# Altium project ECSE478 - Demo Expansion Board.PrjPcb
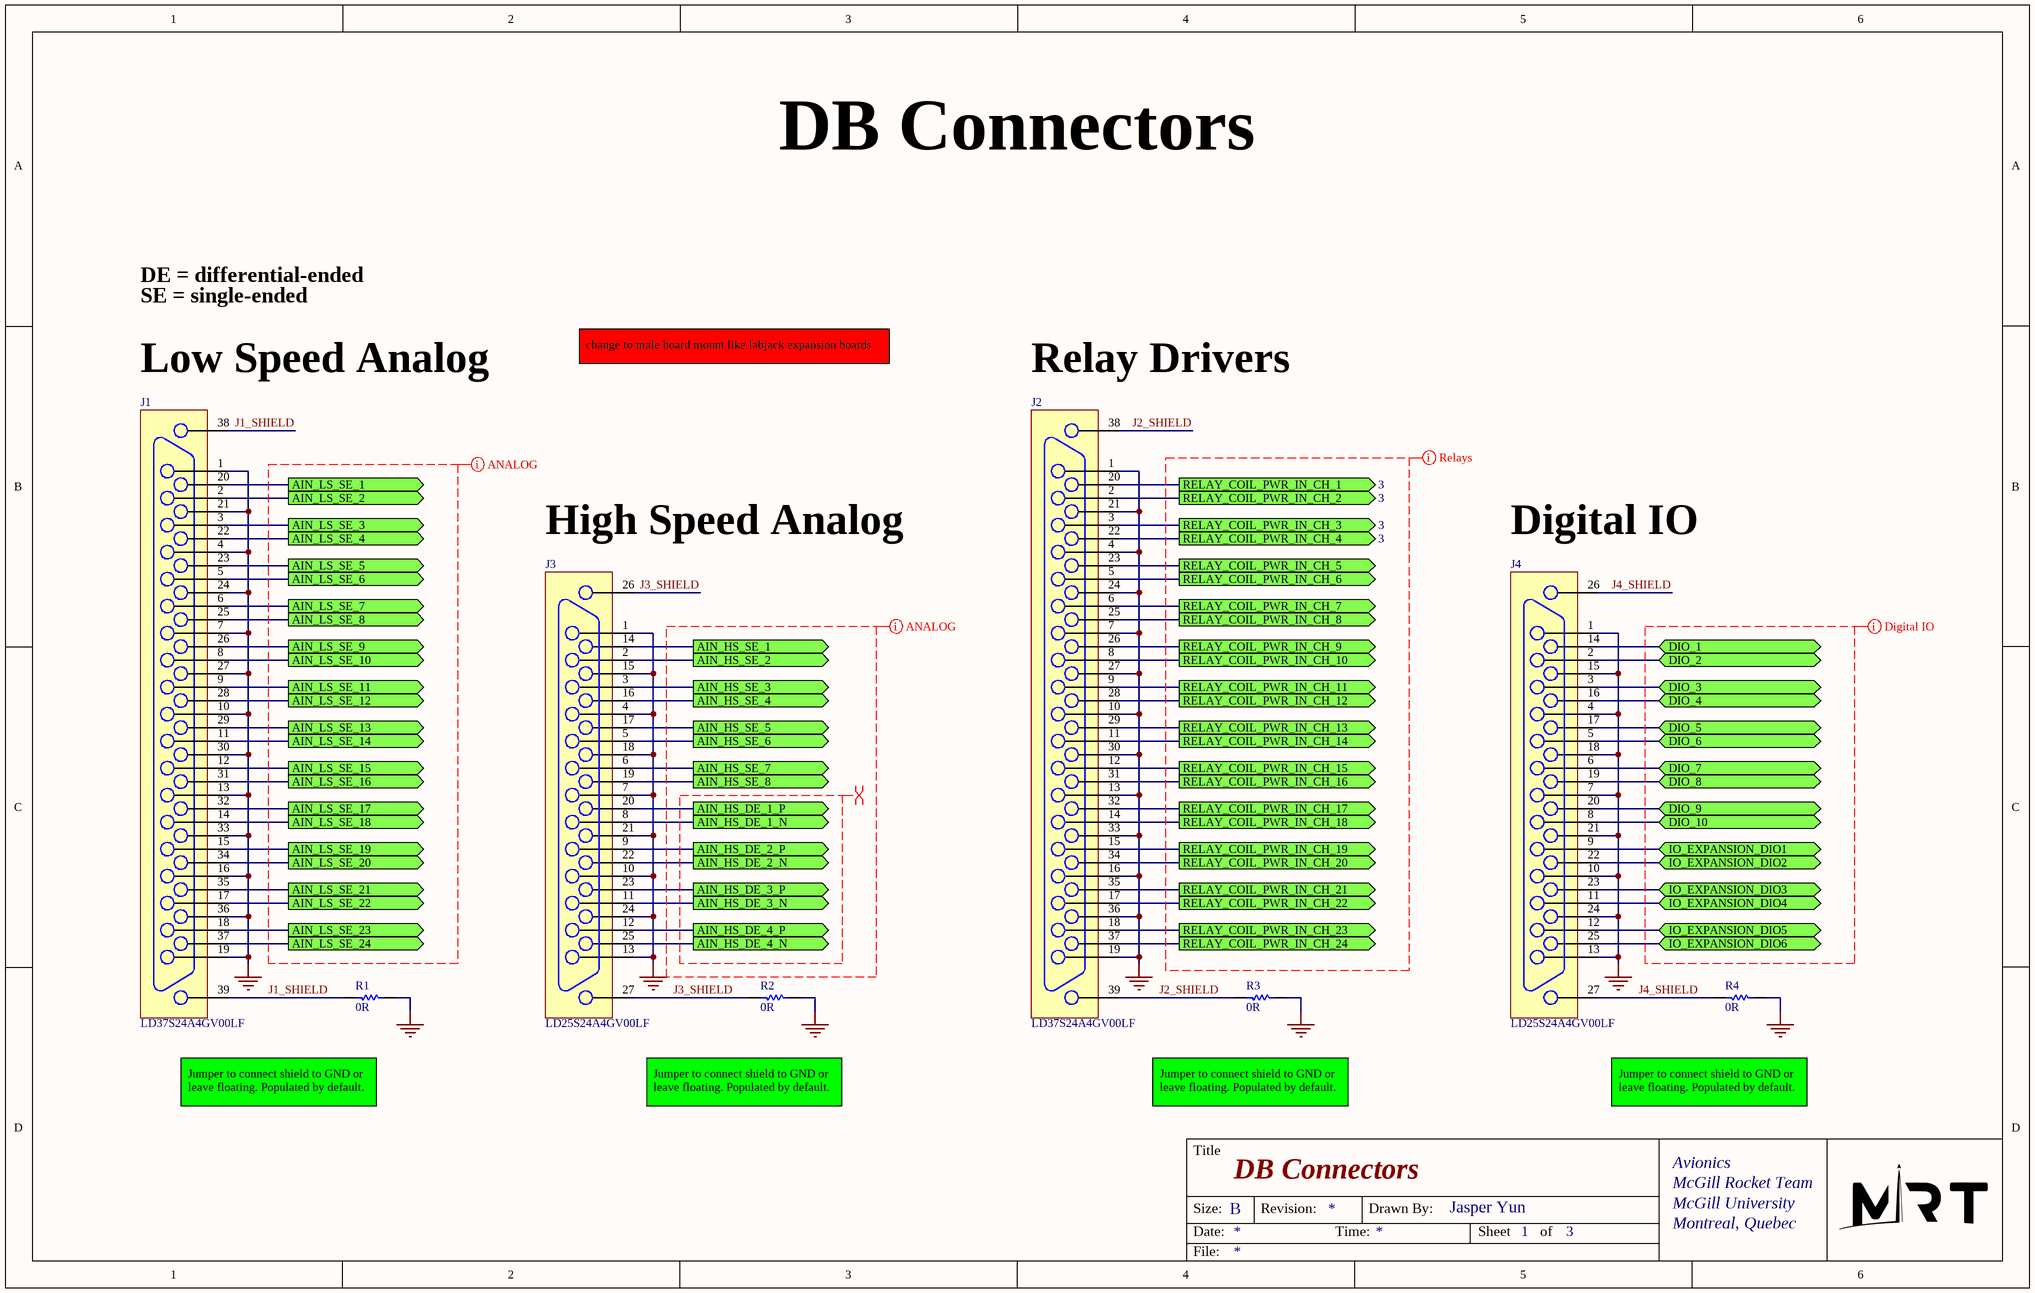
[diagram p0: DB Connectors.SchDoc]
4 sheets, 52 parts. Net scope: flat (ports and power ports of the same name join across sheets).
Sheets:
  DB Connectors.SchDoc
  Power.SchDoc
  Relays and Digital.SchDoc
  Analog Circuits.SchDoc

## Sheet DB Connectors.SchDoc: DB Connectors
size B; DrawnBy: Jasper Yun; SheetNumber: 1; SheetTotal: 3; Competition: SAC 2021; Subteam: Avionics; University: McGill University; Location: Montreal, Quebec; Project: Avionics Project Name; MRT: McGill Rocket Team

### Parts
J1  LD37S24A4GV00LF  [Connector DB37 Vertical LD37S24A4GV00LF]
J2  LD37S24A4GV00LF  [Connector DB37 Vertical LD37S24A4GV00LF]
J3  LD25S24A4GV00LF  [Connector DB25 Vertical LD25S24A4GV00LF]
J4  LD25S24A4GV00LF  [Connector DB25 Vertical LD25S24A4GV00LF]
R1  0R  [0402 RES]
R2  0R  [0402 RES]
R3  0R  [0402 RES]
R4  0R  [0402 RES]

### Ports
AIN_HS_DE_1_N (out), AIN_HS_DE_1_P (out), AIN_HS_DE_2_N (out), AIN_HS_DE_2_P (out), AIN_HS_DE_3_N (out), AIN_HS_DE_3_P (out), AIN_HS_DE_4_N (out), AIN_HS_DE_4_P (out), AIN_HS_SE_1 (out), AIN_HS_SE_2 (out), AIN_HS_SE_3 (out), AIN_HS_SE_4 (out), AIN_HS_SE_5 (out), AIN_HS_SE_6 (out), AIN_HS_SE_7 (out), AIN_HS_SE_8 (out), AIN_LS_SE_1 (out), AIN_LS_SE_2 (out), AIN_LS_SE_3 (out), AIN_LS_SE_4 (out), AIN_LS_SE_5 (out), AIN_LS_SE_6 (out), AIN_LS_SE_7 (out), AIN_LS_SE_8 (out), AIN_LS_SE_9 (out), AIN_LS_SE_10 (out), AIN_LS_SE_11 (out), AIN_LS_SE_12 (out), AIN_LS_SE_13 (out), AIN_LS_SE_14 (out), AIN_LS_SE_15 (out), AIN_LS_SE_16 (out), AIN_LS_SE_17 (out), AIN_LS_SE_18 (out), AIN_LS_SE_19 (out), AIN_LS_SE_20 (out), AIN_LS_SE_21 (out), AIN_LS_SE_22 (out), AIN_LS_SE_23 (out), AIN_LS_SE_24 (out), DIO_1 (bidir), DIO_2 (bidir), DIO_3 (bidir), DIO_4 (bidir), DIO_5 (bidir), DIO_6 (bidir), DIO_7 (bidir), DIO_8 (bidir), DIO_9 (bidir), DIO_10 (bidir), IO_EXPANSION_DIO1 (bidir), IO_EXPANSION_DIO2 (bidir), IO_EXPANSION_DIO3 (bidir), IO_EXPANSION_DIO4 (bidir), IO_EXPANSION_DIO5 (bidir), IO_EXPANSION_DIO6 (bidir), RELAY_COIL_PWR_IN_CH_1 (out, see 3), RELAY_COIL_PWR_IN_CH_2 (out, see 3), RELAY_COIL_PWR_IN_CH_3 (out, see 3), RELAY_COIL_PWR_IN_CH_4 (out, see 3), RELAY_COIL_PWR_IN_CH_5 (out), RELAY_COIL_PWR_IN_CH_6 (out), RELAY_COIL_PWR_IN_CH_7 (out), RELAY_COIL_PWR_IN_CH_8 (out), RELAY_COIL_PWR_IN_CH_9 (out), RELAY_COIL_PWR_IN_CH_10 (out), RELAY_COIL_PWR_IN_CH_11 (out), RELAY_COIL_PWR_IN_CH_12 (out), RELAY_COIL_PWR_IN_CH_13 (out), RELAY_COIL_PWR_IN_CH_14 (out), RELAY_COIL_PWR_IN_CH_15 (out), RELAY_COIL_PWR_IN_CH_16 (out), RELAY_COIL_PWR_IN_CH_17 (out), RELAY_COIL_PWR_IN_CH_18 (out), RELAY_COIL_PWR_IN_CH_19 (out), RELAY_COIL_PWR_IN_CH_20 (out), RELAY_COIL_PWR_IN_CH_21 (out), RELAY_COIL_PWR_IN_CH_22 (out), RELAY_COIL_PWR_IN_CH_23 (out), RELAY_COIL_PWR_IN_CH_24 (out)

### Nets
GND: J1.1 J1.4 J1.7 J1.10 J1.13 J1.16 J1.19 J1.21 J1.24 J1.27 J1.30 J1.33 J1.36 J2.1 J2.4 J2.7 J2.10 J2.13 J2.16 J2.19 J2.21 J2.24 J2.27 J2.30 J2.33 J2.36 J3.1 J3.4 J3.7 J3.10 J3.13 J3.15 J3.18 J3.21 J3.24 J4.1 J4.4 J4.7 J4.10 J4.13 J4.15 J4.18 J4.21 J4.24 R1.2 R2.2 R3.2 R4.2
J1_SHIELD: J1.38 J1.39 R1.1
J2_SHIELD: J2.38 J2.39 R3.1
J3_SHIELD: J3.26 J3.27 R2.1
J4_SHIELD: J4.26 J4.27 R4.1
NetD1_2: J2.20 ; port RELAY_COIL_PWR_IN_CH_1
NetD2_2: J2.2 ; port RELAY_COIL_PWR_IN_CH_2
NetD3_2: J2.3 ; port RELAY_COIL_PWR_IN_CH_3
NetD4_2: J2.22 ; port RELAY_COIL_PWR_IN_CH_4
NetJ1_2: J1.2 ; port AIN_LS_SE_2
NetJ1_3: J1.3 ; port AIN_LS_SE_3
NetJ1_5: J1.5 ; port AIN_LS_SE_6
NetJ1_6: J1.6 ; port AIN_LS_SE_7
NetJ1_8: J1.8 ; port AIN_LS_SE_10
NetJ1_9: J1.9 ; port AIN_LS_SE_11
NetJ1_11: J1.11 ; port AIN_LS_SE_14
NetJ1_12: J1.12 ; port AIN_LS_SE_15
NetJ1_14: J1.14 ; port AIN_LS_SE_18
NetJ1_15: J1.15 ; port AIN_LS_SE_19
NetJ1_17: J1.17 ; port AIN_LS_SE_22
NetJ1_18: J1.18 ; port AIN_LS_SE_23
NetJ1_20: J1.20 ; port AIN_LS_SE_1
NetJ1_22: J1.22 ; port AIN_LS_SE_4
NetJ1_23: J1.23 ; port AIN_LS_SE_5
NetJ1_25: J1.25 ; port AIN_LS_SE_8
NetJ1_26: J1.26 ; port AIN_LS_SE_9
NetJ1_28: J1.28 ; port AIN_LS_SE_12
NetJ1_29: J1.29 ; port AIN_LS_SE_13
NetJ1_31: J1.31 ; port AIN_LS_SE_16
NetJ1_32: J1.32 ; port AIN_LS_SE_17
NetJ1_34: J1.34 ; port AIN_LS_SE_20
NetJ1_35: J1.35 ; port AIN_LS_SE_21
NetJ1_37: J1.37 ; port AIN_LS_SE_24
NetJ2_5: J2.5 ; port RELAY_COIL_PWR_IN_CH_6
NetJ2_6: J2.6 ; port RELAY_COIL_PWR_IN_CH_7
NetJ2_8: J2.8 ; port RELAY_COIL_PWR_IN_CH_10
NetJ2_9: J2.9 ; port RELAY_COIL_PWR_IN_CH_11
NetJ2_11: J2.11 ; port RELAY_COIL_PWR_IN_CH_14
NetJ2_12: J2.12 ; port RELAY_COIL_PWR_IN_CH_15
NetJ2_14: J2.14 ; port RELAY_COIL_PWR_IN_CH_18
NetJ2_15: J2.15 ; port RELAY_COIL_PWR_IN_CH_19
NetJ2_17: J2.17 ; port RELAY_COIL_PWR_IN_CH_22
NetJ2_18: J2.18 ; port RELAY_COIL_PWR_IN_CH_23
NetJ2_23: J2.23 ; port RELAY_COIL_PWR_IN_CH_5
NetJ2_25: J2.25 ; port RELAY_COIL_PWR_IN_CH_8
NetJ2_26: J2.26 ; port RELAY_COIL_PWR_IN_CH_9
NetJ2_28: J2.28 ; port RELAY_COIL_PWR_IN_CH_12
NetJ2_29: J2.29 ; port RELAY_COIL_PWR_IN_CH_13
NetJ2_31: J2.31 ; port RELAY_COIL_PWR_IN_CH_16
NetJ2_32: J2.32 ; port RELAY_COIL_PWR_IN_CH_17
NetJ2_34: J2.34 ; port RELAY_COIL_PWR_IN_CH_20
NetJ2_35: J2.35 ; port RELAY_COIL_PWR_IN_CH_21
NetJ2_37: J2.37 ; port RELAY_COIL_PWR_IN_CH_24
NetJ3_2: J3.2 ; port AIN_HS_SE_2
NetJ3_3: J3.3 ; port AIN_HS_SE_3
NetJ3_5: J3.5 ; port AIN_HS_SE_6
NetJ3_6: J3.6 ; port AIN_HS_SE_7
NetJ3_8: J3.8 ; port AIN_HS_DE_1_N
NetJ3_9: J3.9 ; port AIN_HS_DE_2_P
NetJ3_11: J3.11 ; port AIN_HS_DE_3_N
NetJ3_12: J3.12 ; port AIN_HS_DE_4_P
NetJ3_14: J3.14 ; port AIN_HS_SE_1
NetJ3_16: J3.16 ; port AIN_HS_SE_4
NetJ3_17: J3.17 ; port AIN_HS_SE_5
NetJ3_19: J3.19 ; port AIN_HS_SE_8
NetJ3_20: J3.20 ; port AIN_HS_DE_1_P
NetJ3_22: J3.22 ; port AIN_HS_DE_2_N
NetJ3_23: J3.23 ; port AIN_HS_DE_3_P
NetJ3_25: J3.25 ; port AIN_HS_DE_4_N
NetJ4_2: J4.2 ; port DIO_2
NetJ4_3: J4.3 ; port DIO_3
NetJ4_5: J4.5 ; port DIO_6
NetJ4_6: J4.6 ; port DIO_7
NetJ4_8: J4.8 ; port DIO_10
NetJ4_9: J4.9 ; port IO_EXPANSION_DIO1
NetJ4_11: J4.11 ; port IO_EXPANSION_DIO4
NetJ4_12: J4.12 ; port IO_EXPANSION_DIO5
NetJ4_14: J4.14 ; port DIO_1
NetJ4_16: J4.16 ; port DIO_4
NetJ4_17: J4.17 ; port DIO_5
NetJ4_19: J4.19 ; port DIO_8
NetJ4_20: J4.20 ; port DIO_9
NetJ4_22: J4.22 ; port IO_EXPANSION_DIO2
NetJ4_23: J4.23 ; port IO_EXPANSION_DIO3
NetJ4_25: J4.25 ; port IO_EXPANSION_DIO6

### Layout directives
differential pair; differential pair class AIN_HS_DE: (no net found under the mark)
net class ANALOG: (no net found under the mark)
net class Digital IO: (no net found under the mark)
net class Relays: (no net found under the mark)

### Notes on the sheet
- DE = differential-ended
- SE = single-ended
- change to male board mount like labjack expansion boards
- (near J1) Low Speed Analog
- (near J2) Relay Drivers
- (near J3) High Speed Analog
- (near J4) Digital IO
- Jumper to connect shield to GND or leave floating. Populated by default.
- Title
- Size:
- Date:
- B
- Revision:
- Time:
- Drawn By:
- Sheet
- of
- File:

### Library data of the parts
J1 J2 = Connector DB37 (LD37S24A4GV00LF): DB37 LD37S24A4GV00LF (Amphenol ICC)
J3 J4 = Connector DB25 (LD25S24A4GV00LF): DB25 LD25S24A4GV00LF (Amphenol ICC)
R1-R4 = Res1: Resistor; Value: 1%; Published: 8-Jun-2000; LatestRevisionDate: 17-Jul-2002; LatestRevisionNote: Re-released for DXP Platform.; PackageReference: AXIAL-0.3; Publisher: Altium Limited; PackageDescription: Axial Device, Thru-Hole; 2 Leads; 0.3 in Pin Spacing

## Sheet Power.SchDoc: Power
size B; DrawnBy: Jasper Yun; SheetNumber: 2; SheetTotal: 3; Competition: SAC 2021; Subteam: Avionics; University: McGill University; Location: Montreal, Quebec; Project: Avionics Project Name; MRT: McGill Rocket Team
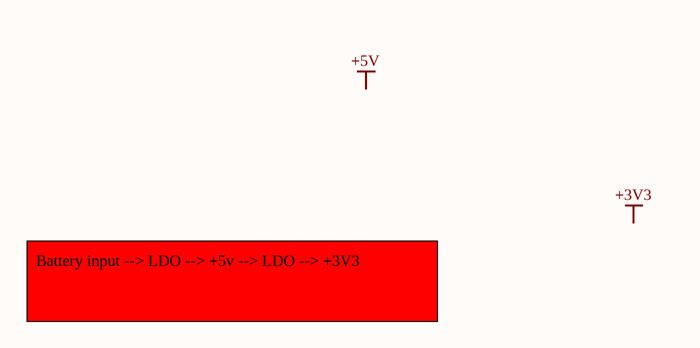
[diagram p1: Power.SchDoc]

### Notes on the sheet
- Battery input --> LDO --> +5v --> LDO --> +3V3
- Labels drawn without touching a wire or pin: +3V3, +5V
- Title
- Size:
- Date:
- B
- Revision:
- Time:
- Drawn By:
- Sheet
- of
- File:

## Sheet Relays and Digital.SchDoc: Relays and Digital
size B; DrawnBy: Jasper Yun; SheetNumber: 3; SheetTotal: 3; Competition: SAC 2021; Subteam: Avionics; University: McGill University; Location: Montreal, Quebec; Project: Avionics Project Name; MRT: McGill Rocket Team
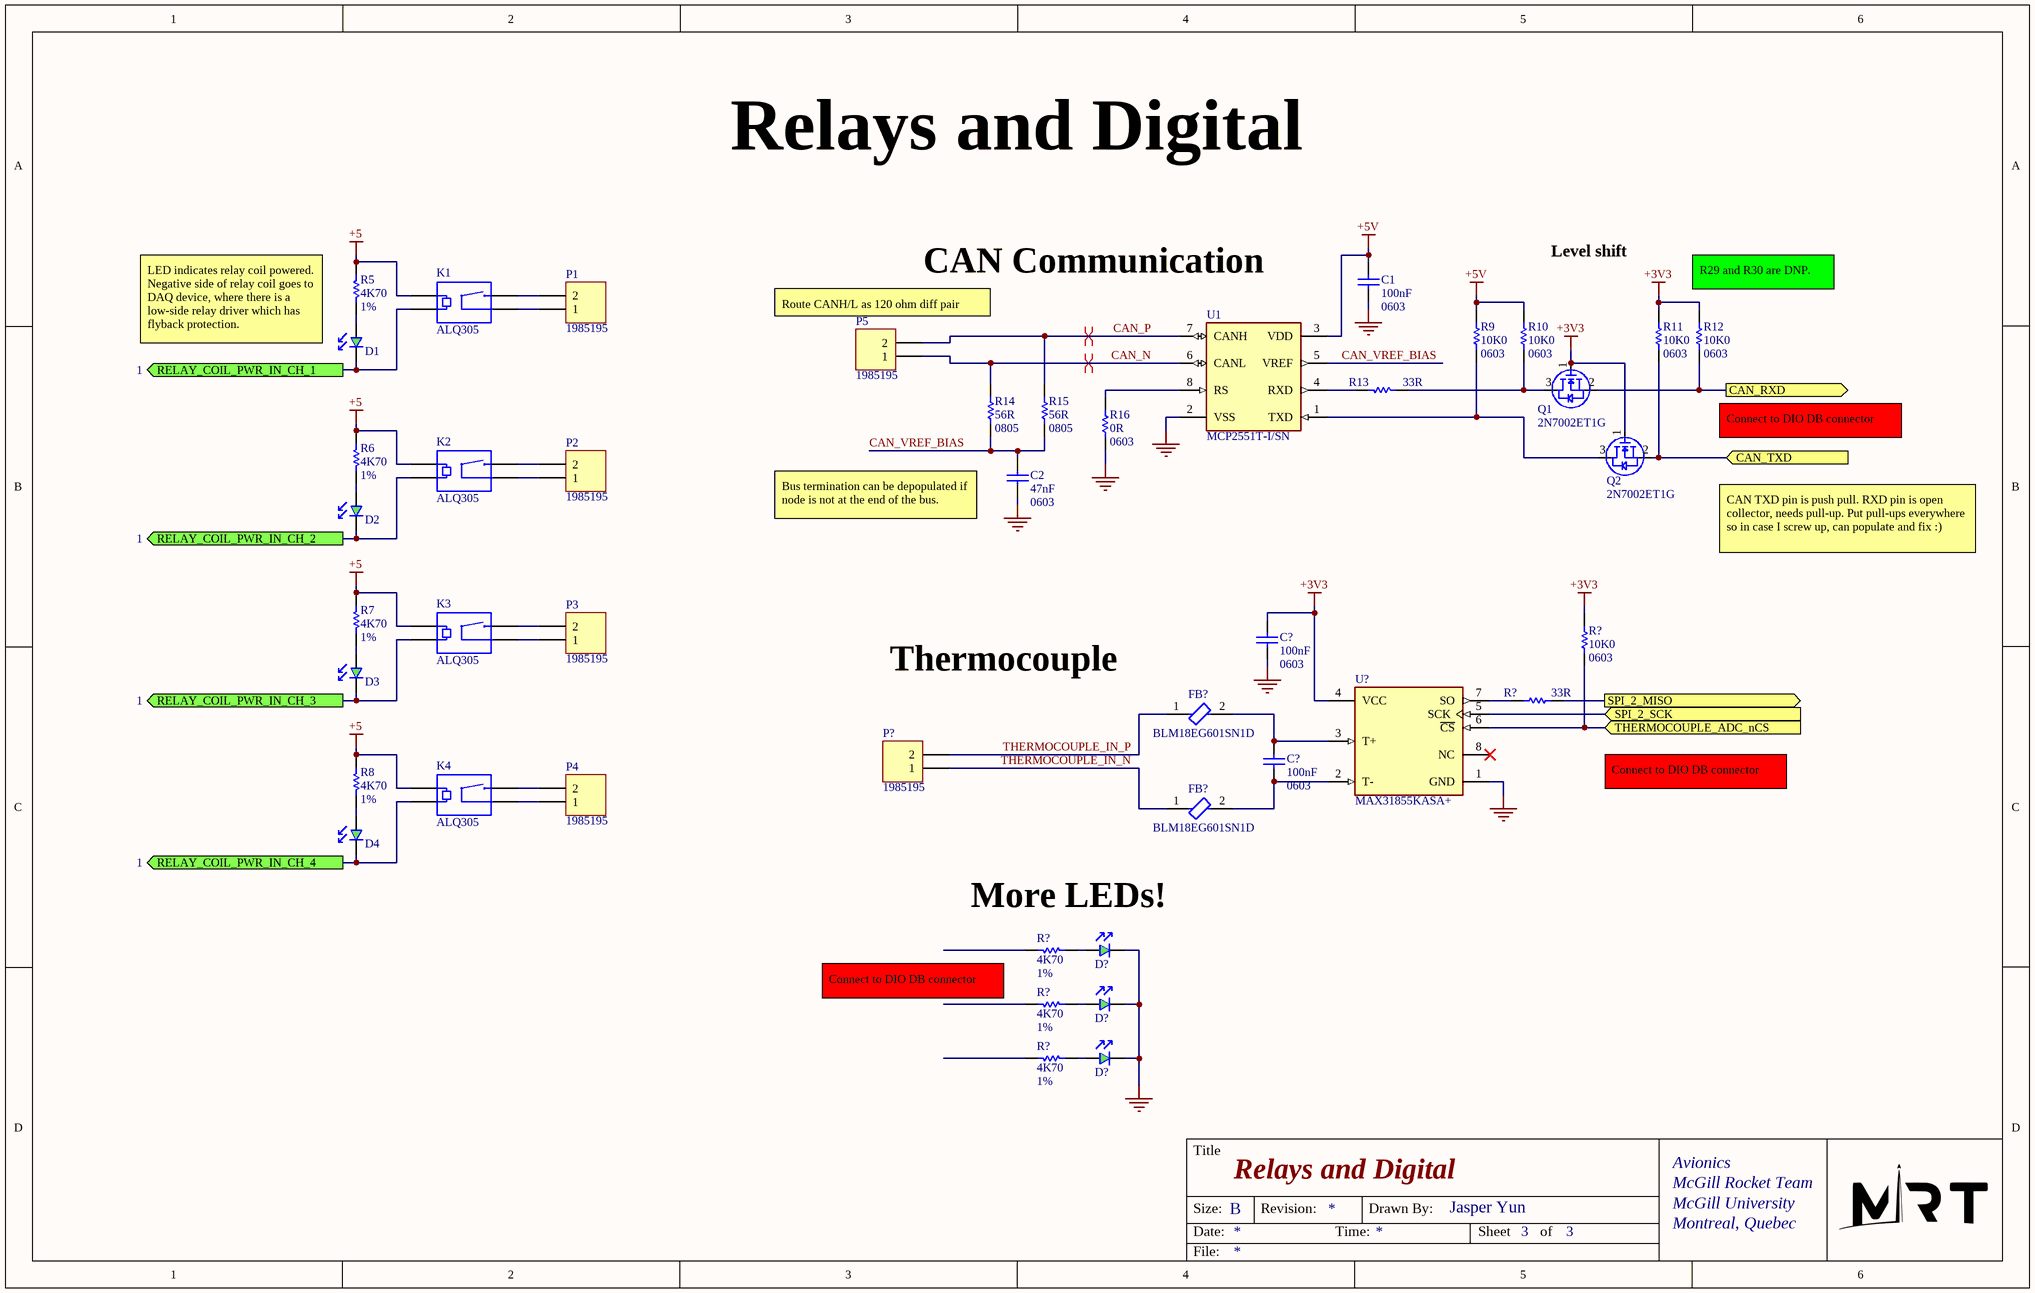
[diagram p2: Relays and Digital.SchDoc]

### Parts
(Parts that share a designator on the sheet are numbered #1, #2 ... from top to bottom, then left to right.)
C1  100nF  value 0603  [0603 CAP SAMSUNG CL10C]
C2  47nF  value 0603  [0603 CAP SAMSUNG CL10C]
C?#1  100nF  value 0603  [0603 CAP SAMSUNG CL10C]
C?#2  100nF  value 0603  [0603 CAP SAMSUNG CL10C]
D1  LED Green  [0603 LED]  (value not drawn)
D2  LED Green  [0603 LED]  (value not drawn)
D3  LED Green  [0603 LED]  (value not drawn)
D4  LED Green  [0603 LED]  (value not drawn)
D?#1  LED Green  [0603 LED]  (value not drawn)
D?#2  LED Green  [0603 LED]  (value not drawn)
D?#3  LED Green  [0603 LED]  (value not drawn)
FB?#1  BLM18EG601SN1D  [FP-BLM18-0_15-t0_8-MFG]
FB?#2  BLM18EG601SN1D  [FP-BLM18-0_15-t0_8-MFG]
K1  ALQ305  [RELAY ALQ305 FORM A]
K2  ALQ305  [RELAY ALQ305 FORM A]
K3  ALQ305  [RELAY ALQ305 FORM A]
K4  ALQ305  [RELAY ALQ305 FORM A]
P1  1985195  [Terminal Block 1985195 2-pos 3.5mm pitch]
P2  1985195  [Terminal Block 1985195 2-pos 3.5mm pitch]
P3  1985195  [Terminal Block 1985195 2-pos 3.5mm pitch]
P4  1985195  [Terminal Block 1985195 2-pos 3.5mm pitch]
P5  1985195  [Terminal Block 1985195 2-pos 3.5mm pitch]
P?  1985195  [Terminal Block 1985195 2-pos 3.5mm pitch]
Q1  2N7002ET1G  [SOT23-3]
Q2  2N7002ET1G  [SOT23-3]
R5  4K70  value 1%  [0603 RES]
R6  4K70  value 1%  [0603 RES]
R7  4K70  value 1%  [0603 RES]
R8  4K70  value 1%  [0603 RES]
R9  10K0  value 0603  [0603 RES]
R10  10K0  value 0603  [0603 RES]
R11  10K0  value 0603  [0603 RES]
R12  10K0  value 0603  [0603 RES]
R13  33R  [0603 RES]
R14  56R  value 0805  [0805 RES]
R15  56R  value 0805  [0805 RES]
R16  0R  value 0603  [0603 RES]
R?#1  10K0  value 0603  [0603 RES]
R?#2  33R  [0603 RES]
R?#3  4K70  value 1%  [0603 RES]
R?#4  4K70  value 1%  [0603 RES]
R?#5  4K70  value 1%  [0603 RES]
U1  MCP2551T-I/SN  [FP-C04-057-SN-IPC_B]
U?  MAX31855KASA+  [FP-S8-4-MFG]

### Ports
CAN_RXD (out), CAN_TXD (in), RELAY_COIL_PWR_IN_CH_1 (out, see 1), RELAY_COIL_PWR_IN_CH_2 (out, see 1), RELAY_COIL_PWR_IN_CH_3 (out, see 1), RELAY_COIL_PWR_IN_CH_4 (out, see 1), SPI_2_MISO (out), SPI_2_SCK (in), THERMOCOUPLE_ADC_nCS (in)

### Nets
+3V3: C?#1.2 Q1.1(Gate) Q2.1(Gate) R11.2 R12.2 R?#1.2 U?.4(VCC)
+5: K1.1 K2.1 K3.1 K4.1 R5.2 R6.2 R7.2 R8.2
+5V: C1.2 R9.2 R10.2 U1.3(VDD)
GND: C1.1 C2.1 C?#1.1 D?#1.2(Cathode) D?#2.2(Cathode) D?#3.2(Cathode) R16.1 U1.2(VSS) U?.1(GND)
CAN_N: P5.1 R14.2 U1.6(CANL)
CAN_P: P5.2 R15.2 U1.7(CANH)
CAN_VREF_BIAS: C2.2 R14.1 R15.1 U1.5(VREF)
THERMOCOUPLE_IN_N: FB?#2.1 P?.1
THERMOCOUPLE_IN_P: FB?#1.1 P?.2
NetC?#2_1: C?#2.1 FB?#2.2 U?.2(T-)
NetC?#2_2: C?#2.2 FB?#1.2 U?.3(T+)
NetD1_1: D1.1(Anode) R5.1
NetD1_2: D1.2(Cathode) K1.2 ; port RELAY_COIL_PWR_IN_CH_1
NetD2_1: D2.1(Anode) R6.1
NetD2_2: D2.2(Cathode) K2.2 ; port RELAY_COIL_PWR_IN_CH_2
NetD3_1: D3.1(Anode) R7.1
NetD3_2: D3.2(Cathode) K3.2 ; port RELAY_COIL_PWR_IN_CH_3
NetD4_1: D4.1(Anode) R8.1
NetD4_2: D4.2(Cathode) K4.2 ; port RELAY_COIL_PWR_IN_CH_4
NetD?#1_1: D?#1.1(Anode) R?#3.1
NetD?#2_1: D?#2.1(Anode) R?#4.1
NetD?#3_1: D?#3.1(Anode) R?#5.1
NetK1_3: K1.3 P1.1
NetK1_4: K1.4 P1.2
NetK2_3: K2.3 P2.1
NetK2_4: K2.4 P2.2
NetK3_3: K3.3 P3.1
NetK3_4: K3.4 P3.2
NetK4_3: K4.3 P4.1
NetK4_4: K4.4 P4.2
NetQ1_2: Q1.2(Source) R12.1 ; port CAN_RXD
NetQ1_3: Q1.3(Drain) R10.1 R13.1
NetQ2_2: Q2.2(Source) R11.1 ; port CAN_TXD
NetQ2_3: Q2.3(Drain) R9.1 U1.1(TXD)
NetR13_2: R13.2 U1.4(RXD)
NetR16_2: R16.2 U1.8(RS)
NetR?#1_1: R?#1.1 U?.6(~{CS}) ; port THERMOCOUPLE_ADC_nCS
NetR?#2_1: R?#2.1 U?.7(SO)
NetR?#2_2: R?#2.2 ; port SPI_2_MISO
NetU?_5: U?.5(SCK) ; port SPI_2_SCK

Not connected (* = marked no-connect by the designer): R?#3 2; R?#4 2; R?#5 2; U? 8(NC)*

### Layout directives
differential pair: CAN_N, CAN_P

### Notes on the sheet
- CAN Communication
- Level shift
- R29 and R30 are DNP.
- LED indicates relay coil powered. Negative side of relay coil goes to DAQ device, where there is a low-side relay driver which has flyback protection.
- (near P5) Route CANH/L as 120 ohm diff pair
- Connect to DIO DB connector
- Bus termination can be depopulated if node is not at the end of the bus.
- CAN TXD pin is push pull. RXD pin is open collector, needs pull-up. Put pull-ups everywhere so in case I screw up, can populate and fix :)
- Thermocouple
- More LEDs!
- (near R?#4) Connect to DIO DB connector
- Title
- Size:
- Date:
- B
- Revision:
- Time:
- Drawn By:
- Sheet
- of
- File:

### Library data of the parts
C1 C2 C?#1 C?#2 = Cap: Capacitor; Published: 8-Jun-2000; LatestRevisionDate: 17-Jul-2002; LatestRevisionNote: Re-released for DXP Platform.; PackageReference: RAD-0.3; Publisher: Altium Limited; PackageDescription: Radial Cap, Thru-Hole; 2 Leads; 0.3 in Pin Spacing
D1-D4 D?#1-D?#3 = LED Green: Generic Green LED
FB?#1 FB?#2 = CMP-0686-00354-3: Chip Ferrite Bead, 0603, 600Ω @ 100MHz, 0.35Ω, 25%, 500mA; Manufacturer Series: BLM18E; Number of Lines: 1; DC Resistance (DCR): 350mR; Impedance: 600R; Material: Steel; Shielding: Unshielded; Package Quantity: 1; Case/Package: 0603; Length: 1.6mm; Packaging: Tape and Reel; Resistance: 350mR; REACH SVHC: No SVHC; Military Standard: Not; Contact Plating: Tin; Termination: SMD/SMT; Number of Circuits: 1; Width: 0.8mm; Test Frequency: 100MHz; DC Current: 500mA; Case Code (Metric): 1608; Max DC Current: 500mA; Max Operating Temperature: 125°C; Current Rating: 500mA; Series: BLM18E; Tolerance: 25%; Min Operating Temperature: -55°C; Frequency: 100MHz; Lead Free: Lead Free; Terminal Finish: Tin; Number of Pins: 2; Max Current Rating: 500mA; Radiation Hardening: No; Case Code (Imperial): 0603; Number of Functions: 1; Depth: 0.8mm; DC Resistance-Max: 350mR; Height: 0.8mm; Core Material: Ferrite; RoHS Compliant: Yes
K1-K4 = Relay ALQ305: RELAY GEN PURPOSE SPST 10A 5V; Manufacturer: Panasonic; Voltage Rating (AC): 250V; Power Rating: 200mW; Coil Resistance: 125R; Coil Current: 40mA; Operate Time: 20ms; Coil Type: Non-Latching; Relay Type: General Purpose; Supplier 1: Digi-Key; Supplier Part Number 1: 255-3559-ND; Manufacturer Part Number: ALQ305; RoHS: Yes; Category: Power Relays; Stock 1: 83; Pricing 1: 1=1.06000, 10=0.99000, 25=0.88000, 50=0.83600, 100=0.79200, 250=0.70400, 500=0.66000, 1000=0.61600, 5000=0.59400 (USD); Number of Pins: 4; Contact Material: Silver; Weight: 7g; Min Operating Temperature: -40°C; Max Operating Temperature: 85°C; Contact Current Rating: 10A; Package Quantity: 100; Packaging: Carton; Power Consumption: 200mW; Throw Configuration: SPST; Termination: PC Pin; Release Time: 20ms; Coil Power: 200mW; Max Voltage Rating (AC): 250V; Coil Voltage (DC): 5V; Length: 20mm; Width: 10mm; Height: 16mm; Depth: 10mm; REACH SVHC: Unknown; Lead Free: Lead Free; ComponentLink1URL: http://www.mouser.com/ds/2/315/lq-catalog-1075796.pdf?src-supplier=Mouser; ComponentLink1Description: http://www.mouser.com/ds/2/315/lq-catalog-1075796.pdf?src-supplier=Mouser; ComponentLink2URL: http://www.alliedelec.com/m/d/b3e6213128df2023f710f2e9cac83292.pdf?src-supplier=Allied+Electronics; ComponentLink2Description: http://www.alliedelec.com/m/d/b3e6213128df2023f710f2e9cac83292.pdf?src-supplier=Allied+Electronics; ComponentLink3URL: http://www.farnell.com/datasheets/2245159.pdf?src-supplier=Farnell; ComponentLink3Description: http://www.farnell.com/datasheets/2245159.pdf?src-supplier=Farnell; ComponentLink4URL: http://components.arrow.com/part/dataview/0323_06571503?src-supplier=Arrow+Europe; ComponentLink4Description: http://components.arrow.com/part/dataview/0323_06571503?src-supplier=Arrow+Europe; ComponentLink5URL: https://media.digikey.com/pdf/Data%20Sheets/Panasonic%20Electric%20Works%20PDFs/ALQ(LQ)Relays_NewProdIntro.pdf?src-supplier=Digi-Key; ComponentLink5Description: https://media.digikey.com/pdf/Data%20Sheets/Panasonic%20Electric%20Works%20PDFs/ALQ(LQ)Relays_NewProdIntro.pdf?src-supplier=Digi-Key; ComponentLink6URL: http://www.farnell.com/datasheets/1972641.pdf?src-supplier=Element14; ComponentLink6Description: http://www.farnell.com/datasheets/1972641.pdf?src-supplier=Element14; ComponentLink7URL: http://www.farnell.com/datasheets/2245159.pdf?src-supplier=Newark; ComponentLink7Description: http://www.farnell.com/datasheets/2245159.pdf?src-supplier=Newark; ComponentLink8URL: http://pewa.panasonic.com/assets/pcsd/catalog/lq-catalog.pdf?src-supplier=Avnet; ComponentLink8Description: http://pewa.panasonic.com/assets/pcsd/catalog/lq-catalog.pdf?src-supplier=Avnet
P1-P5 P? = Header 2: Header, 2-Pin; LatestRevisionDate: 17-Jul-2002; LatestRevisionNote: Re-released for DXP Platform.; Publisher: Altium Limited
Q1 Q2 = NMOS: Generic N-channel MOSFET
R5-R12 R14-R16 R?#1 R?#3-R?#5 = Res1: Resistor; Published: 8-Jun-2000; LatestRevisionDate: 17-Jul-2002; LatestRevisionNote: Re-released for DXP Platform.; PackageReference: AXIAL-0.3; Publisher: Altium Limited; PackageDescription: Axial Device, Thru-Hole; 2 Leads; 0.3 in Pin Spacing
R13 R?#2 = Res1: RC0603FR-0733RL / 0603 / in stock; Value: 1K; Published: 8-Jun-2000; LatestRevisionDate: 17-Jul-2002; LatestRevisionNote: Re-released for DXP Platform.; PackageReference: AXIAL-0.3; Publisher: Altium Limited; PackageDescription: Axial Device, Thru-Hole; 2 Leads; 0.3 in Pin Spacing
U1 = CMP-0186-00037-3: IC TRANSCEIVER HALF 1/1 8SOIC; Interface: CAN; Nominal Supply Current: 75mA; Number of Receive Buffers: 1; Operating Supply Voltage: 5V; Data Rate: 1Mbps; Max Supply Voltage: 5.5V; Min Supply Voltage: 4.5V; Package Quantity: 3300; Packaging: Tape and Reel; REACH SVHC: No SVHC; Radiation Hardening: No; Case/Package: SOIC; Max Supply Current: 75mA; Lead Free: Lead Free; Number of Transmit Buffers: 1; Length: 4.9mm; Number of Transceivers: 1; Min Operating Temperature: -40°C; Number of Pins: 8; Height: 1.5mm; Max Operating Temperature: 85°C; Number of Receivers: 1; Logic Function: Transceiver; Width: 3.9mm; Mount: Surface Mount; Number of Drivers: 1
U? = CMP-0253-00403-2: IC CONV THERMOCOUPLE-DGTL SOIC; Max Supply Voltage: 3.6V; Operating Supply Current: 900uA; Resolution: 14b; Min Supply Voltage: 3V; Output Type: Digital; Interface: SPI; Max Supply Current: 1.5mA; Operating Supply Voltage: 3.3V; Contact Plating: Tin; Packaging: Rail/Tube; Height: 1.5mm; Radiation Hardening: No; Max Operating Temperature: 125°C; Weight: 0.01787oz; Min Operating Temperature: -40°C; Package Quantity: 100; Width: 4mm; Case/Package: SO; Number of Pins: 8; Lead Free: Lead Free; Length: 5mm

## Sheet Analog Circuits.SchDoc: Analog Circuits
size B; DrawnBy: Jasper Yun; SheetNumber: 4; SheetTotal: 4; Competition: SAC 2021; Subteam: Avionics; University: McGill University; Location: Montreal, Quebec; Project: Avionics Project Name; MRT: McGill Rocket Team
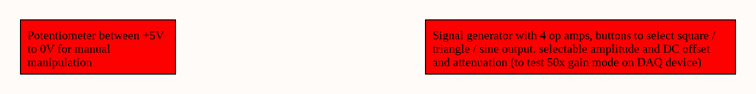
[diagram p3: Analog Circuits.SchDoc]

### Notes on the sheet
- Potentiometer between +5V to 0V for manual manipulation
- Signal generator with 4 op amps, buttons to select square / triangle / sine output. selectable amplitude and DC offset and attenuation (to test 50x gain mode on DAQ device)
- Title
- Size:
- Date:
- B
- Revision:
- Time:
- Drawn By:
- Sheet
- of
- File:

## Nets that join several sheets
GND: DB Connectors (48 pins), Relays and Digital (9 pins)
NetD1_2: DB Connectors (J2.20), Relays and Digital (D1.2 K1.2)
NetD2_2: DB Connectors (J2.2), Relays and Digital (D2.2 K2.2)
NetD3_2: DB Connectors (J2.3), Relays and Digital (D3.2 K3.2)
NetD4_2: DB Connectors (J2.22), Relays and Digital (D4.2 K4.2)